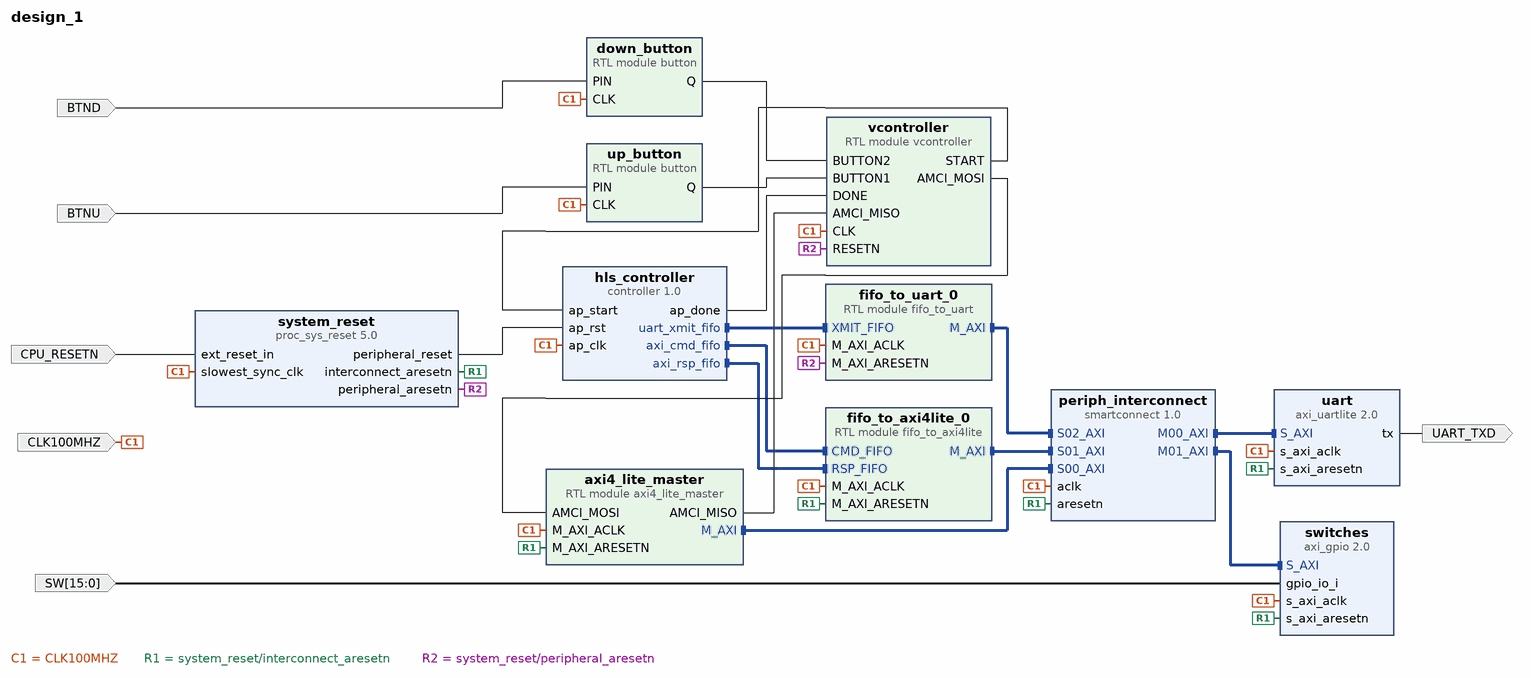
[diagram p0: block diagram of the top level]
# Vivado block design design_1, xc7a100tcsg324-1, Vivado 2021.2
create_bd_design design_1

create_bd_port -dir I -type rst CPU_RESETN
create_bd_port -dir I -type clk CLK100MHZ
create_bd_port -dir O UART_TXD
create_bd_port -dir I BTNU
create_bd_port -dir I BTND
create_bd_port -dir I -from 15 -to 0 SW

create_bd_cell -type ip -vlnv xilinx.com:ip:proc_sys_reset:5.0 system_reset
create_bd_cell -type ip -vlnv xilinx.com:ip:axi_uartlite:2.0 uart
set_property -dict [list \
  CONFIG.C_BAUDRATE 115200 \
  CONFIG.UARTLITE_BOARD_INTERFACE Custom \
  CONFIG.USE_BOARD_FLOW true \
] [get_bd_cells uart]
create_bd_cell -type module -reference axi4_lite_master axi4_lite_master
create_bd_cell -type module -reference button up_button
create_bd_cell -type module -reference button down_button
create_bd_cell -type ip -vlnv xilinx.com:ip:smartconnect:1.0 periph_interconnect
set_property -dict {CONFIG.NUM_MI 2 CONFIG.NUM_SI 3} [get_bd_cells periph_interconnect]
create_bd_cell -type ip -vlnv xilinx.com:ip:axi_gpio:2.0 switches
set_property -dict {CONFIG.C_ALL_INPUTS 1 CONFIG.C_GPIO_WIDTH 16} [get_bd_cells switches]
create_bd_cell -type module -reference fifo_to_axi4lite fifo_to_axi4lite_0
create_bd_cell -type module -reference vcontroller vcontroller
create_bd_cell -type module -reference fifo_to_uart fifo_to_uart_0
create_bd_cell -type ip -vlnv xilinx.com:hls:controller:1.0 hls_controller

# ---- connections ----

connect_bd_intf_net [get_bd_intf_pins periph_interconnect/S01_AXI] [get_bd_intf_pins fifo_to_axi4lite_0/M_AXI]
connect_bd_intf_net -intf_net axi4_lite_master_0_M_AXI [get_bd_intf_pins axi4_lite_master/M_AXI] [get_bd_intf_pins periph_interconnect/S00_AXI]
connect_bd_intf_net -intf_net controller_0_uart_xmit_fifo [get_bd_intf_pins fifo_to_uart_0/XMIT_FIFO] [get_bd_intf_pins hls_controller/uart_xmit_fifo]
connect_bd_intf_net [get_bd_intf_pins fifo_to_uart_0/M_AXI] [get_bd_intf_pins periph_interconnect/S02_AXI]
connect_bd_intf_net [get_bd_intf_pins fifo_to_axi4lite_0/CMD_FIFO] [get_bd_intf_pins hls_controller/axi_cmd_fifo]
connect_bd_intf_net [get_bd_intf_pins fifo_to_axi4lite_0/RSP_FIFO] [get_bd_intf_pins hls_controller/axi_rsp_fifo]
connect_bd_intf_net [get_bd_intf_pins switches/S_AXI] [get_bd_intf_pins periph_interconnect/M01_AXI]
connect_bd_intf_net -intf_net smartconnect_0_M00_AXI [get_bd_intf_pins periph_interconnect/M00_AXI] [get_bd_intf_pins uart/S_AXI]
connect_bd_net -net PIN_0_1 [get_bd_ports BTNU] [get_bd_pins up_button/PIN]
connect_bd_net -net PIN_0_2 [get_bd_ports BTND] [get_bd_pins down_button/PIN]
connect_bd_net -net axi4_lite_master_0_AMCI_MISO [get_bd_pins axi4_lite_master/AMCI_MISO] [get_bd_pins vcontroller/AMCI_MISO]
connect_bd_net -net button_0_Q [get_bd_pins up_button/Q] [get_bd_pins vcontroller/BUTTON1]
connect_bd_net -net controller_0_ap_done [get_bd_pins hls_controller/ap_done] [get_bd_pins vcontroller/DONE]
connect_bd_net [get_bd_pins down_button/Q] [get_bd_pins vcontroller/BUTTON2]
connect_bd_net -net ext_reset_in_0_1 [get_bd_ports CPU_RESETN] [get_bd_pins system_reset/ext_reset_in]
connect_bd_net -net gpio_io_i_0_1 [get_bd_ports SW] [get_bd_pins switches/gpio_io_i]
connect_bd_net -net slowest_sync_clk_0_1 [get_bd_ports CLK100MHZ] \
  [get_bd_pins system_reset/slowest_sync_clk] [get_bd_pins uart/s_axi_aclk] [get_bd_pins axi4_lite_master/M_AXI_ACLK] \
  [get_bd_pins up_button/CLK] [get_bd_pins down_button/CLK] [get_bd_pins periph_interconnect/aclk] \
  [get_bd_pins switches/s_axi_aclk] [get_bd_pins fifo_to_axi4lite_0/M_AXI_ACLK] [get_bd_pins vcontroller/CLK] \
  [get_bd_pins fifo_to_uart_0/M_AXI_ACLK] [get_bd_pins hls_controller/ap_clk]
connect_bd_net [get_bd_pins system_reset/interconnect_aresetn] \
  [get_bd_pins uart/s_axi_aresetn] [get_bd_pins axi4_lite_master/M_AXI_ARESETN] [get_bd_pins periph_interconnect/aresetn] \
  [get_bd_pins switches/s_axi_aresetn] [get_bd_pins fifo_to_axi4lite_0/M_AXI_ARESETN]
connect_bd_net [get_bd_pins system_reset/peripheral_aresetn] [get_bd_pins vcontroller/RESETN] [get_bd_pins fifo_to_uart_0/M_AXI_ARESETN]
connect_bd_net [get_bd_pins system_reset/peripheral_reset] [get_bd_pins hls_controller/ap_rst]
connect_bd_net [get_bd_pins uart/tx] [get_bd_ports UART_TXD]
connect_bd_net -net vcontroller_0_AMCI_MOSI [get_bd_pins vcontroller/AMCI_MOSI] [get_bd_pins axi4_lite_master/AMCI_MOSI]
connect_bd_net [get_bd_pins vcontroller/START] [get_bd_pins hls_controller/ap_start]

# ---- address map ----
assign_bd_address -offset 0x40600000 -range 64K -target_address_space [get_bd_addr_spaces axi4_lite_master/M_AXI] [get_bd_addr_segs uart/S_AXI/Reg]
assign_bd_address -offset 0x40700000 -range 64K -target_address_space [get_bd_addr_spaces axi4_lite_master/M_AXI] [get_bd_addr_segs switches/S_AXI/Reg]
assign_bd_address -offset 0x40600000 -range 64K -target_address_space [get_bd_addr_spaces fifo_to_axi4lite_0/M_AXI] [get_bd_addr_segs uart/S_AXI/Reg]
assign_bd_address -offset 0x40700000 -range 64K -target_address_space [get_bd_addr_spaces fifo_to_axi4lite_0/M_AXI] [get_bd_addr_segs switches/S_AXI/Reg]
assign_bd_address -offset 0x40600000 -range 64K -target_address_space [get_bd_addr_spaces fifo_to_uart_0/M_AXI] [get_bd_addr_segs uart/S_AXI/Reg]
assign_bd_address -offset 0x40700000 -range 64K -target_address_space [get_bd_addr_spaces fifo_to_uart_0/M_AXI] [get_bd_addr_segs switches/S_AXI/Reg]

validate_bd_design
save_bd_design
